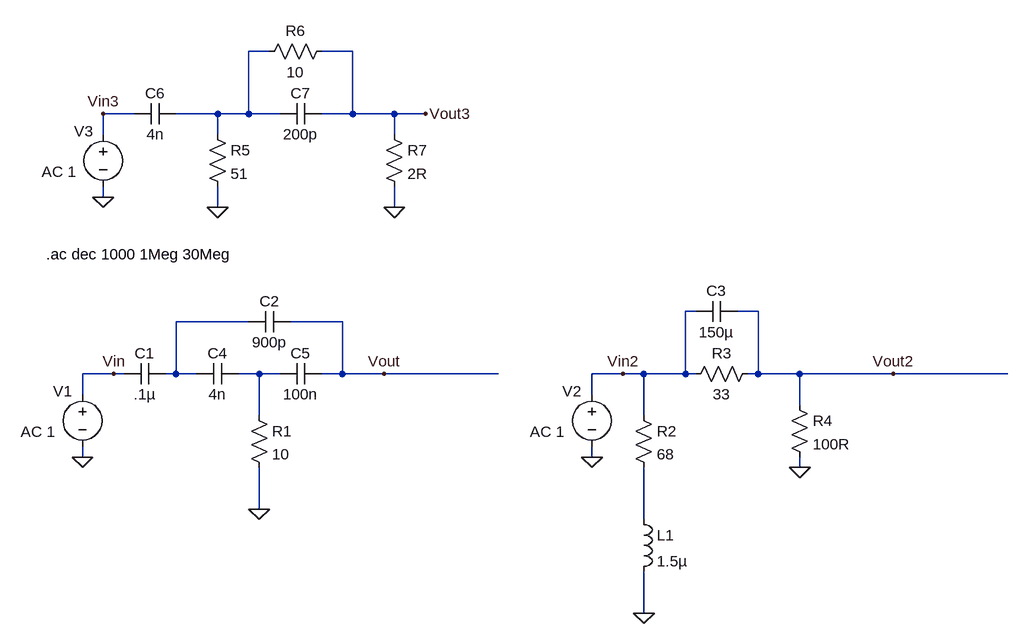
[diagram p0: schematic Front End Z Compansation.asc]
Front End Z Compansation.asc, the LTspice schematic file:
Version 4
SHEET 1 1492 680
WIRE 352 -320 320 -320
WIRE 480 -320 432 -320
WIRE 144 -224 96 -224
WIRE 272 -224 208 -224
WIRE 320 -224 320 -320
WIRE 320 -224 272 -224
WIRE 368 -224 320 -224
WIRE 480 -224 480 -320
WIRE 480 -224 432 -224
WIRE 544 -224 480 -224
WIRE 592 -224 544 -224
WIRE 96 -192 96 -224
WIRE 272 -192 272 -224
WIRE 544 -192 544 -224
WIRE 96 -96 96 -112
WIRE 272 -80 272 -112
WIRE 544 -80 544 -112
WIRE 1008 80 992 80
WIRE 1104 80 1072 80
WIRE 320 96 208 96
WIRE 464 96 384 96
WIRE 112 176 64 176
WIRE 128 176 112 176
WIRE 208 176 208 96
WIRE 208 176 192 176
WIRE 240 176 208 176
WIRE 336 176 304 176
WIRE 368 176 336 176
WIRE 464 176 464 96
WIRE 464 176 432 176
WIRE 528 176 464 176
WIRE 704 176 528 176
WIRE 896 176 848 176
WIRE 928 176 896 176
WIRE 992 176 992 80
WIRE 992 176 928 176
WIRE 1008 176 992 176
WIRE 1104 176 1104 80
WIRE 1104 176 1088 176
WIRE 1168 176 1104 176
WIRE 1312 176 1168 176
WIRE 1488 176 1312 176
WIRE 64 208 64 176
WIRE 848 208 848 176
WIRE 1168 224 1168 176
WIRE 336 240 336 176
WIRE 928 240 928 176
WIRE 64 304 64 288
WIRE 848 304 848 288
WIRE 1168 320 1168 304
WIRE 336 384 336 320
WIRE 928 400 928 320
WIRE 928 544 928 480
FLAG 64 304 0
FLAG 112 176 Vin
FLAG 336 384 0
FLAG 528 176 Vout
FLAG 848 304 0
FLAG 896 176 Vin2
FLAG 928 544 0
FLAG 1312 176 Vout2
FLAG 1168 320 0
FLAG 272 -80 0
FLAG 96 -96 0
FLAG 96 -224 Vin3
FLAG 592 -224 Vout3
FLAG 544 -80 0
SYMBOL voltage 64 192 R0
WINDOW 0 -45 11 Left 2
WINDOW 3 -214 95 Left 2
WINDOW 123 -95 73 Left 2
WINDOW 39 -214 151 Left 2
SYMATTR InstName V1
SYMATTR Value ""
SYMATTR Value2 AC 1
SYMBOL cap 192 160 R90
WINDOW 0 0 32 VBottom 2
WINDOW 3 32 32 VTop 2
SYMATTR InstName C1
SYMATTR Value .1µ
SYMBOL cap 384 80 R90
WINDOW 0 0 32 VBottom 2
WINDOW 3 32 32 VTop 2
SYMATTR InstName C2
SYMATTR Value 900p
SYMBOL res 320 224 R0
SYMATTR InstName R1
SYMATTR Value 10
SYMBOL cap 304 160 R90
WINDOW 0 0 32 VBottom 2
WINDOW 3 32 32 VTop 2
SYMATTR InstName C4
SYMATTR Value 4n
SYMBOL cap 432 160 R90
WINDOW 0 0 32 VBottom 2
WINDOW 3 32 32 VTop 2
SYMATTR InstName C5
SYMATTR Value 100n
SYMBOL voltage 848 192 R0
WINDOW 0 -45 11 Left 2
WINDOW 3 -214 95 Left 2
WINDOW 123 -95 73 Left 2
WINDOW 39 -214 151 Left 2
SYMATTR InstName V2
SYMATTR Value ""
SYMATTR Value2 AC 1
SYMBOL res 912 224 R0
SYMATTR InstName R2
SYMATTR Value 68
SYMBOL ind 912 384 R0
SYMATTR InstName L1
SYMATTR Value 1.5µ
SYMBOL res 1104 160 R90
WINDOW 0 0 56 VBottom 2
WINDOW 3 32 56 VTop 2
SYMATTR InstName R3
SYMATTR Value 33
SYMBOL cap 1072 64 R90
WINDOW 0 0 32 VBottom 2
WINDOW 3 32 32 VTop 2
SYMATTR InstName C3
SYMATTR Value 150µ
SYMBOL res 1152 208 R0
SYMATTR InstName R4
SYMATTR Value 100R
SYMBOL cap 208 -240 R90
WINDOW 0 0 32 VBottom 2
WINDOW 3 32 32 VTop 2
SYMATTR InstName C6
SYMATTR Value 4n
SYMBOL res 256 -208 R0
SYMATTR InstName R5
SYMATTR Value 51
SYMBOL cap 432 -240 R90
WINDOW 0 0 32 VBottom 2
WINDOW 3 32 32 VTop 2
SYMATTR InstName C7
SYMATTR Value 200p
SYMBOL res 448 -336 R90
WINDOW 0 0 56 VBottom 2
WINDOW 3 32 56 VTop 2
SYMATTR InstName R6
SYMATTR Value 10
SYMBOL voltage 96 -208 R0
WINDOW 0 -45 11 Left 2
WINDOW 3 -214 95 Left 2
WINDOW 123 -95 73 Left 2
WINDOW 39 -214 151 Left 2
SYMATTR InstName V3
SYMATTR Value ""
SYMATTR Value2 AC 1
SYMBOL res 528 -208 R0
SYMATTR InstName R7
SYMATTR Value 2R
TEXT 8 -8 Left 2 !.ac dec 1000 1Meg 30Meg

The netlist it stands for:
* Front End Z Compansation.asc
V1 Vin 0 AC 1
C1 N002 Vin .1µ
C2 Vout N002 900p
R1 N003 0 10
C4 N003 N002 4n
C5 Vout N003 100n
V2 Vin2 0 AC 1
R2 Vin2 N004 68
L1 N004 0 1.5µ
R3 Vout2 Vin2 33
C3 Vout2 Vin2 150µ
R4 Vout2 0 100R
C6 N001 Vin3 4n
R5 N001 0 51
C7 Vout3 N001 200p
R6 Vout3 N001 10
V3 Vin3 0 AC 1
R7 Vout3 0 2R
.ac dec 1000 1Meg 30Meg
.backanno
.end